# EAGLE design lcd1602a-connector-90deg (EAGLE 7.2.0)
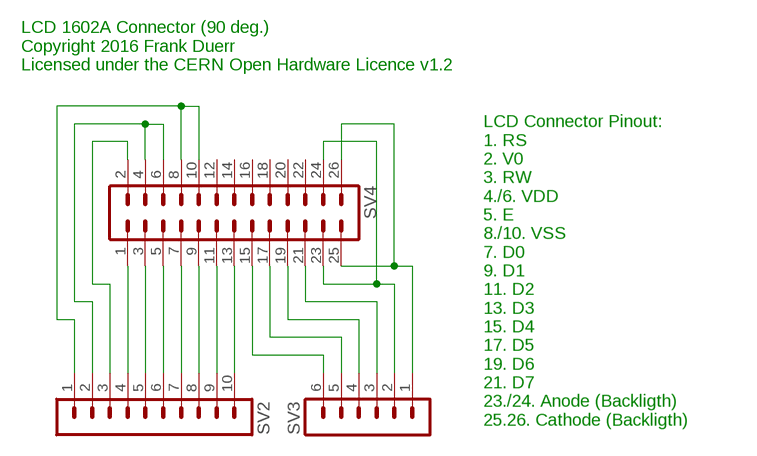
[diagram p0: schematic, sheet 1]

## Parts
SV2  MA10-1  [MA10-1]
SV3  MA06-1  [MA06-1]
SV4  ML26L  [ML26L]

## Nets
N$1: SV2.4 SV4.1
N$2: SV2.5 SV4.3
N$3: SV2.6 SV4.5
N$4: SV2.7 SV4.7
N$5: SV2.8 SV4.9
N$6: SV2.9 SV4.11
N$7: SV2.10 SV4.13
N$8: SV3.6 SV4.15
N$9: SV3.5 SV4.17
N$10: SV3.3 SV4.21
N$11: SV3.2 SV4.23 SV4.24
N$12: SV3.4 SV4.19
N$13: SV3.1 SV4.25 SV4.26
N$14: SV2.3 SV4.2
N$15: SV2.2 SV4.4 SV4.6
N$16: SV2.1 SV4.8 SV4.10
Unconnected: SV4.12 SV4.14 SV4.16 SV4.18 SV4.20 SV4.22

## Notes on the sheet
- LCD 1602A Connector (90 deg.)
  Copyright 2016 Frank Duerr
  Licensed under the CERN Open Hardware Licence v1.2
- LCD Connector Pinout:
  1. RS
  2. V0
  3. RW
  4./6. VDD
  5. E
  8./10. VSS
  7. D0
  9. D1
  11. D2
  13. D3
  15. D4
  17. D5
  19. D6
  21. D7
  23./24. Anode (Backligth)
  25.26. Cathode (Backligth)

## Library data of the parts
SV2 = con-lstb:MA10-1: PIN HEADER; OC_FARNELL: unknown; OC_NEWARK: unknown
SV3 = con-lstb:MA06-1: PIN HEADER; OC_FARNELL: unknown; OC_NEWARK: unknown
SV4 = con-harting-ml:ML26: HARTING; OC_FARNELL: unknown; OC_NEWARK: unknown

## Board
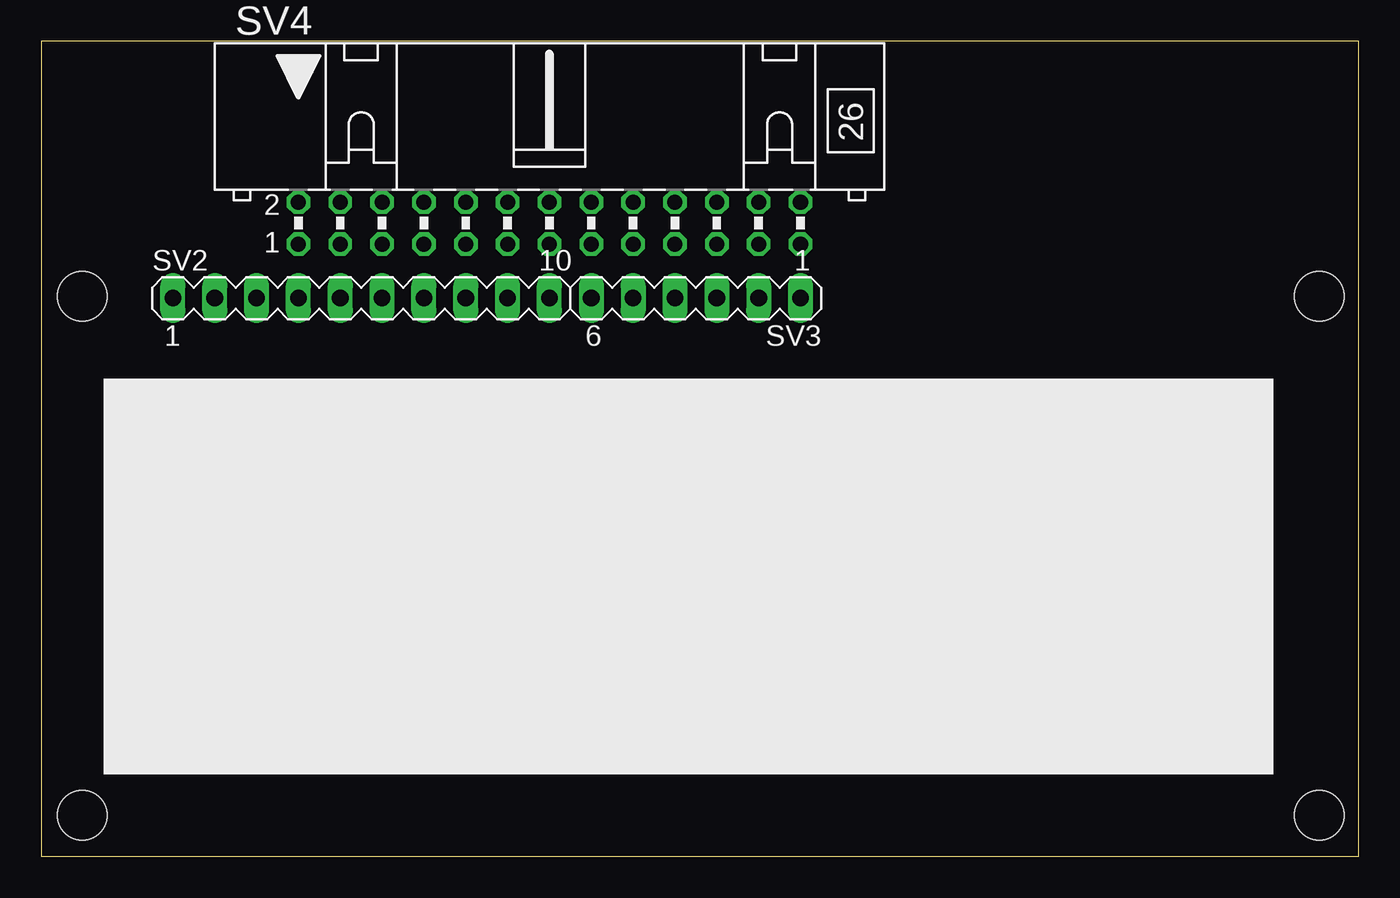
[diagram p1: board, top side]
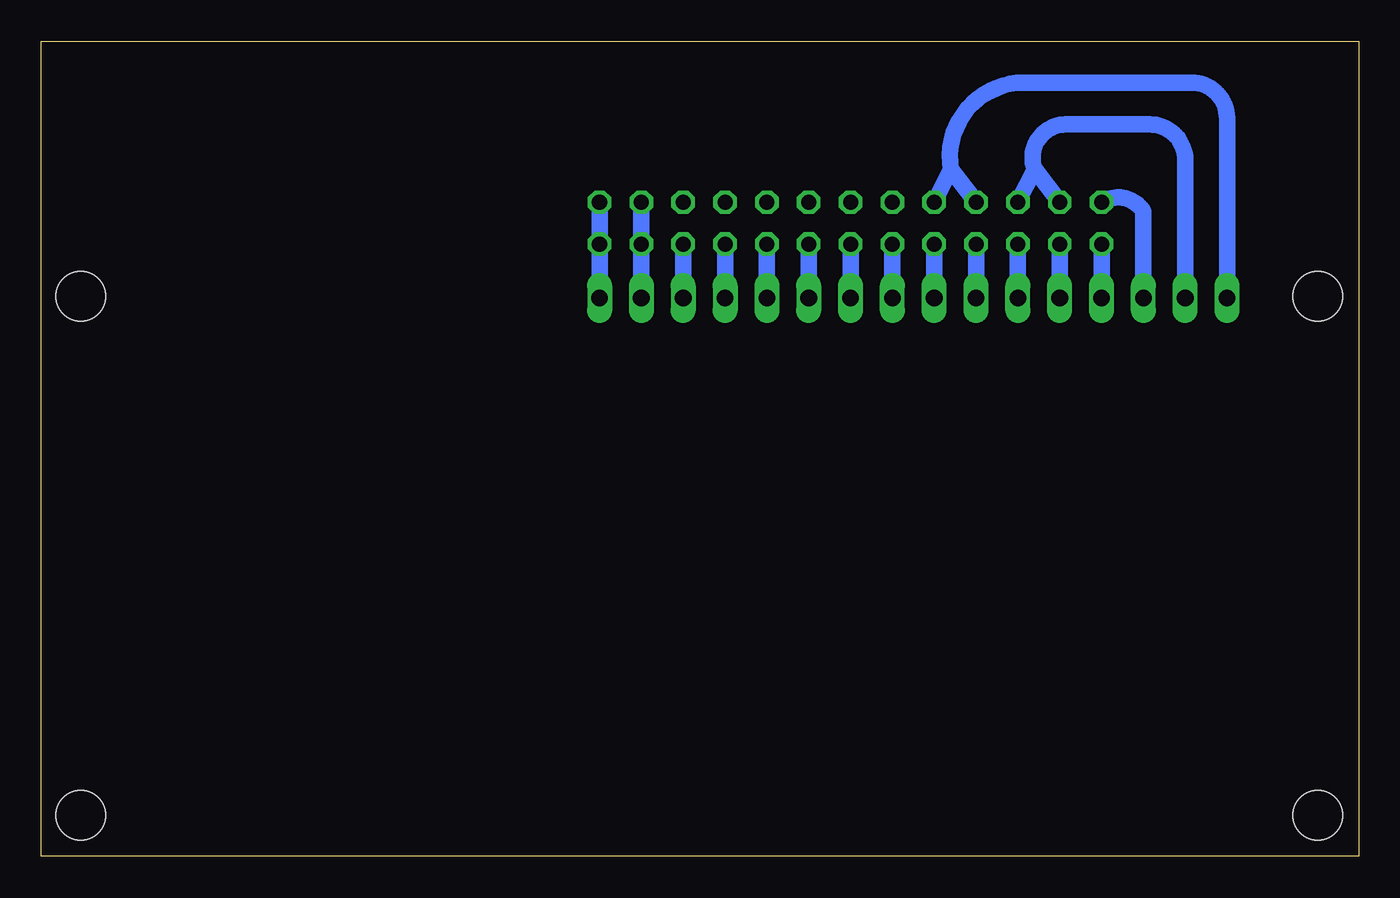
[diagram p2: board, bottom side, seen from below]

Size 80 x 49.5 mm. Coordinates in mm from the lower left corner, seen from the top.
Outline: 0,0 80,0 80,49.5 0,49.5 0,0
Copper layers (1*16): Top 0.035mm / dielectric 1.5mm / Bottom 0.035mm
Design rules "default": minimum track width 10mil, minimum drill 24mil, track to track 8mil, track to pad 8mil, pad to pad 8mil, via to via 8mil, smd to smd 8mil, copper to edge 40mil, drill to drill 8mil, minimum pad ring 10mil, minimum via ring 8mil, stop-mask expansion 4mil, vias tented up to drill 0mil, thermal gap 10mil
Holes 3 mm at 2.5,34 77.6,34 2.5,2.5 77.6,2.5

### Footprints (pad centres in the part's own frame; a part is rotated, then mirrored left to right if it is on the bottom)
MA10-1 = drill 1.016 long: 1 -11.43,0; 2 -8.89,0; 3 -6.35,0; 4 -3.81,0; 5 -1.27,0; 6 1.27,0; 7 3.81,0; 8 6.35,0; 9 8.89,0; 10 11.43,0
MA06-1 = drill 1.016 long: 1 -6.35,0; 2 -3.81,0; 3 -1.27,0; 4 1.27,0; 5 3.81,0; 6 6.35,0
ML26L = drill 0.914 octagon: 1 -15.24,-1.27; 2 -15.24,1.27; 3 -12.7,-1.27; 4 -12.7,1.27; 5 -10.16,-1.27; 6 -10.16,1.27; 7 -7.62,-1.27; 8 -7.62,1.27; 9 -5.08,-1.27; 10 -5.08,1.27; 11 -2.54,-1.27; 12 -2.54,1.27; 13 0,-1.27; 14 0,1.27; 15 2.54,-1.27; 16 2.54,1.27; 17 5.08,-1.27; 18 5.08,1.27; 19 7.62,-1.27; 20 7.62,1.27; 21 10.16,-1.27; 22 10.16,1.27; 23 12.7,-1.27; 24 12.7,1.27; 25 15.24,-1.27; 26 15.24,1.27

### Placement (x,y rotation side)
SV2  19.43,33.9 0 top
SV3  39.75,33.9 180 top
SV4  30.86,38.45 0 top

### Tracks (layer width: path | path; a pad name or v marks a point on that pad's centre or on a via)
N$1
  Bottom 1.016: SV2.4 SV4.1
N$2
  Bottom 1.016: SV2.5 SV4.3
N$3
  Bottom 1.016: SV2.6 SV4.5
N$4
  Bottom 1.016: SV2.7 SV4.7
N$5
  Bottom 1.016: SV2.8 SV4.9
N$6
  Bottom 1.016: SV2.9 SV4.11
N$7
  Bottom 1.016: SV2.10 SV4.13
N$8
  Bottom 1.016: SV3.6 SV4.15
N$9
  Bottom 1.016: SV3.5 SV4.17
N$10
  Bottom 1.016: SV3.3 SV4.21
N$11
  Bottom 1.016: SV3.2 SV4.23 SV4.24
N$12
  Bottom 1.016: SV3.4 SV4.19
N$13
  Bottom 1.016: SV3.1 SV4.25 SV4.26
N$14
  Bottom 1.016: SV2.3 13.08,39.18 arc-90 SV4.2
N$15
  Bottom 1.016: SV2.2 10.54,42.29 arc-90 12.7,44.45 17.78,44.45 arc-110 19.68,41.72 | SV4.4 19.68,41.72 | 19.68,41.72 SV4.6
N$16
  Bottom 1.016: SV2.1 8,44.83 arc-90 10.16,46.99 20.32,46.99 arc-100 24.77,41.72 | SV4.8 24.77,41.72 | 24.77,41.72 SV4.10

### Text on the board
Document: LCD 1602A Connector (90 deg.) / Copyright 2016 Frank Duerr / Licensed under the CERN Open Hardware Licence v1.2